# Altium schematic sheet Wireless Battery Charger.SchDoc
size A4; PageSetup: Record=PageOptions|CenterHorizontal=True|CenterVertical=True|PrintScale=0.97|XCorrection=1.00|YCorrection=1.00|PrintKind=2|BorderSize=5000000|LeftOffset=0|BottomOffset=0|Orientation=2|PaperLength=1000|PaperWidth=1000|Scale=100|PaperSource=7|PrintQuality=-3|MediaType=1|DitherType=10|PrintScaleMode=1|PaperKind=A4|PaperIndex=9
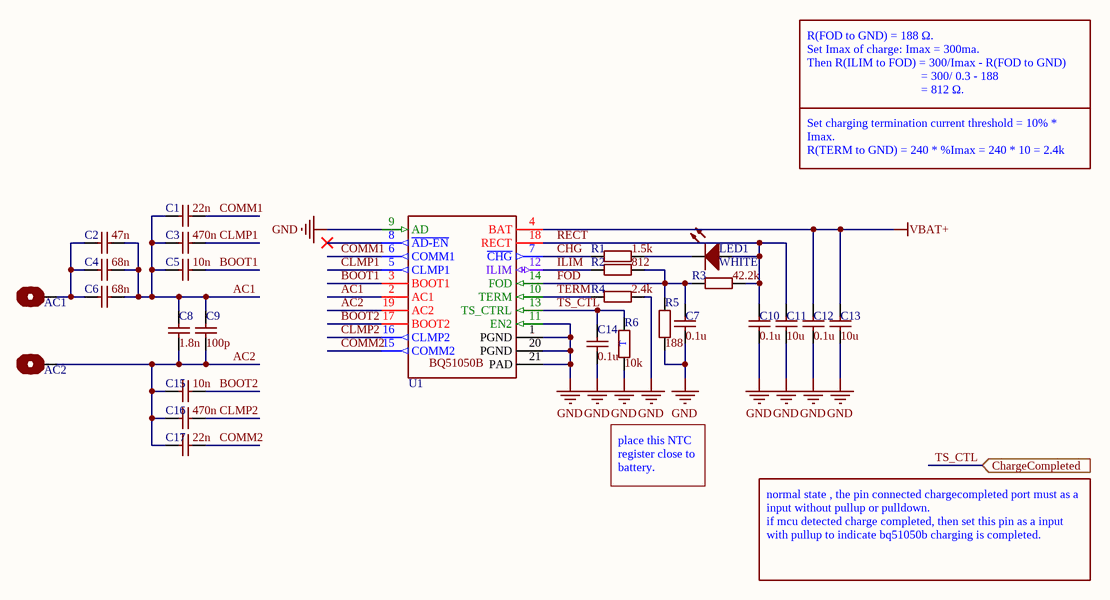
[diagram p0: Wireless Battery Charger.SchDoc]

## Parts
AC1  Pad  [PAD]  (value not drawn)
AC2  Pad  [PAD]  (value not drawn)
C1  value 22n  [C0402_h]  (hidden comment: Capacitor)
C2  value 47n  [C0402_h]  (hidden comment: Capacitor)
C3  value 470n  [C0402_h]  (hidden comment: Capacitor)
C4  value 68n  [C0402_h]  (hidden comment: Capacitor)
C5  value 10n  [C0402_h]  (hidden comment: Capacitor)
C6  value 68n  [C0402_h]  (hidden comment: Capacitor)
C7  value 0.1u  [C0402_h]  (hidden comment: Capacitor)
C8  value 1.8n  [C0402_h]  (hidden comment: Capacitor)
C9  value 100p  [C0402_h]  (hidden comment: Capacitor)
C10  value 0.1u  [C0402_h]  (hidden comment: Capacitor)
C11  value 10u  [C0402_h]  (hidden comment: Capacitor)
C12  value 0.1u  [C0402_h]  (hidden comment: Capacitor)
C13  value 10u  [C0402_h]  (hidden comment: Capacitor)
C14  value 0.1u  [C0402_h]  (hidden comment: Capacitor)
C15  value 10n  [C0402_h]  (hidden comment: Capacitor)
C16  value 470n  [C0402_h]  (hidden comment: Capacitor)
C17  value 22n  [C0402_h]  (hidden comment: Capacitor)
LED1  Color: WHITE  [LED0805]  (hidden comment: LED)
R1  value 1.5k  [R0402]  (hidden comment: Register)
R2  value 812  [R0402]  (hidden comment: Register)
R3  value 42.2k  [R0402]  (hidden comment: Register)
R4  value 2.4k  [R0402]  (hidden comment: Register)
R5  value 188  [R0402]  (hidden comment: Register)
R6  value 10k  [NTC]  (hidden comment: Register)
U1  BQ51050BRHLR  [VQFN-20]  (value not drawn)

## Ports
ChargeCompleted (in)

## Nets
GND: C7.2 C10.1 C11.1 C12.1 C13.1 C14.1 R4.2 R5.2 R6.1 U1.1(PGND) U1.9(AD) U1.11(EN2) U1.20(PGND) U1.21(PAD)
VBAT+: C12.2 C13.2 U1.4(BAT)
AC1: C1.1 C2.2 C3.1 C4.2 C5.1 C6.2 C8.2 C9.2 U1.2(AC1)
AC2: AC2.1 C8.1 C9.1 C15.1 C16.1 C17.1 U1.19(AC2)
BOOT1: C5.2 U1.3(BOOT1)
BOOT2: C15.2 U1.17(BOOT2)
CHG: R1.2 U1.7(~{CHG})
CLMP1: C3.2 U1.5(CLMP1)
CLMP2: C16.2 U1.16(CLMP2)
COMM1: C1.2 U1.6(COMM1)
COMM2: C17.2 U1.15(COMM2)
FOD: C7.1 R2.2 R3.1 R5.1 U1.14(FOD)
ILIM: R2.1 U1.12(ILIM)
RECT: C10.2 C11.2 LED1.1(A) R3.2 U1.18(RECT)
TERM: R4.1 U1.10(TERM)
TS_CTL: C14.2 R6.2 U1.13(TS_CTRL) ; port ChargeCompleted
NetAC1_1: AC1.1 C2.1 C4.1 C6.1
NetLED1_2: LED1.2(K) R1.1

Not connected (* = marked no-connect by the designer): U1 8(~{AD-EN})*

## Notes on the sheet
- R(FOD to GND) = 188 Ω.
  Set Imax of charge: Imax = 300ma.
  Then R(ILIM to FOD) = 300/Imax - R(FOD to GND)
  = 300/ 0.3 - 188
  = 812 Ω.
- Set charging termination current threshold = 10% * Imax.
  R(TERM to GND) = 240 * %Imax = 240 * 10 = 2.4k
- place this NTC register close to battery.
- normal state , the pin connected chargecompleted port must as a input without pullup or pulldown.
  if mcu detected charge completed, then set this pin as a input with pullup to indicate bq51050b charging is completed.
- (in symbol BQ51050BRHLR) BQ51050B
- (in symbol 热敏电阻) T

## Library data of the parts
C1-C17 = 贴片电容-无极性: VDC: 10V; Published: 8-Jun-2000; LatestRevisionDate: 17-Jul-2002; LatestRevisionNote: Re-released for DXP Platform.; PackageReference: RAD-0.3; Publisher: Altium Limited; PackageDescription: Radial Cap, Thru-Hole; 2 Leads; 0.3 in Pin Spacing
R1-R5 = 贴片电阻
R6 = 热敏电阻
U1 = BQ51050BRHLR: 4.2V Li-Ion Wireless Battery Charger, receiver; Manufacturer: Texas Instruments; CompType: IC; PIN_COUNT: 21; PartNumber: BQ51050BRHLR; PackageReference: RHL0020A; MountType: SMT; RoHS: Y; RefDes: RefDes; Type: DEV; Value: Value
LED1 = LED: Published: 8-Jun-2000; LatestRevisionDate: 08-Jul-2005; LatestRevisionNote: Mech Layer 1 removed.; PackageReference: LED-0; Publisher: Altium Limited; PackageDescription: LED; 2 Leads